# EAGLE design mainboard-raspi-3 (EAGLE 6.4)
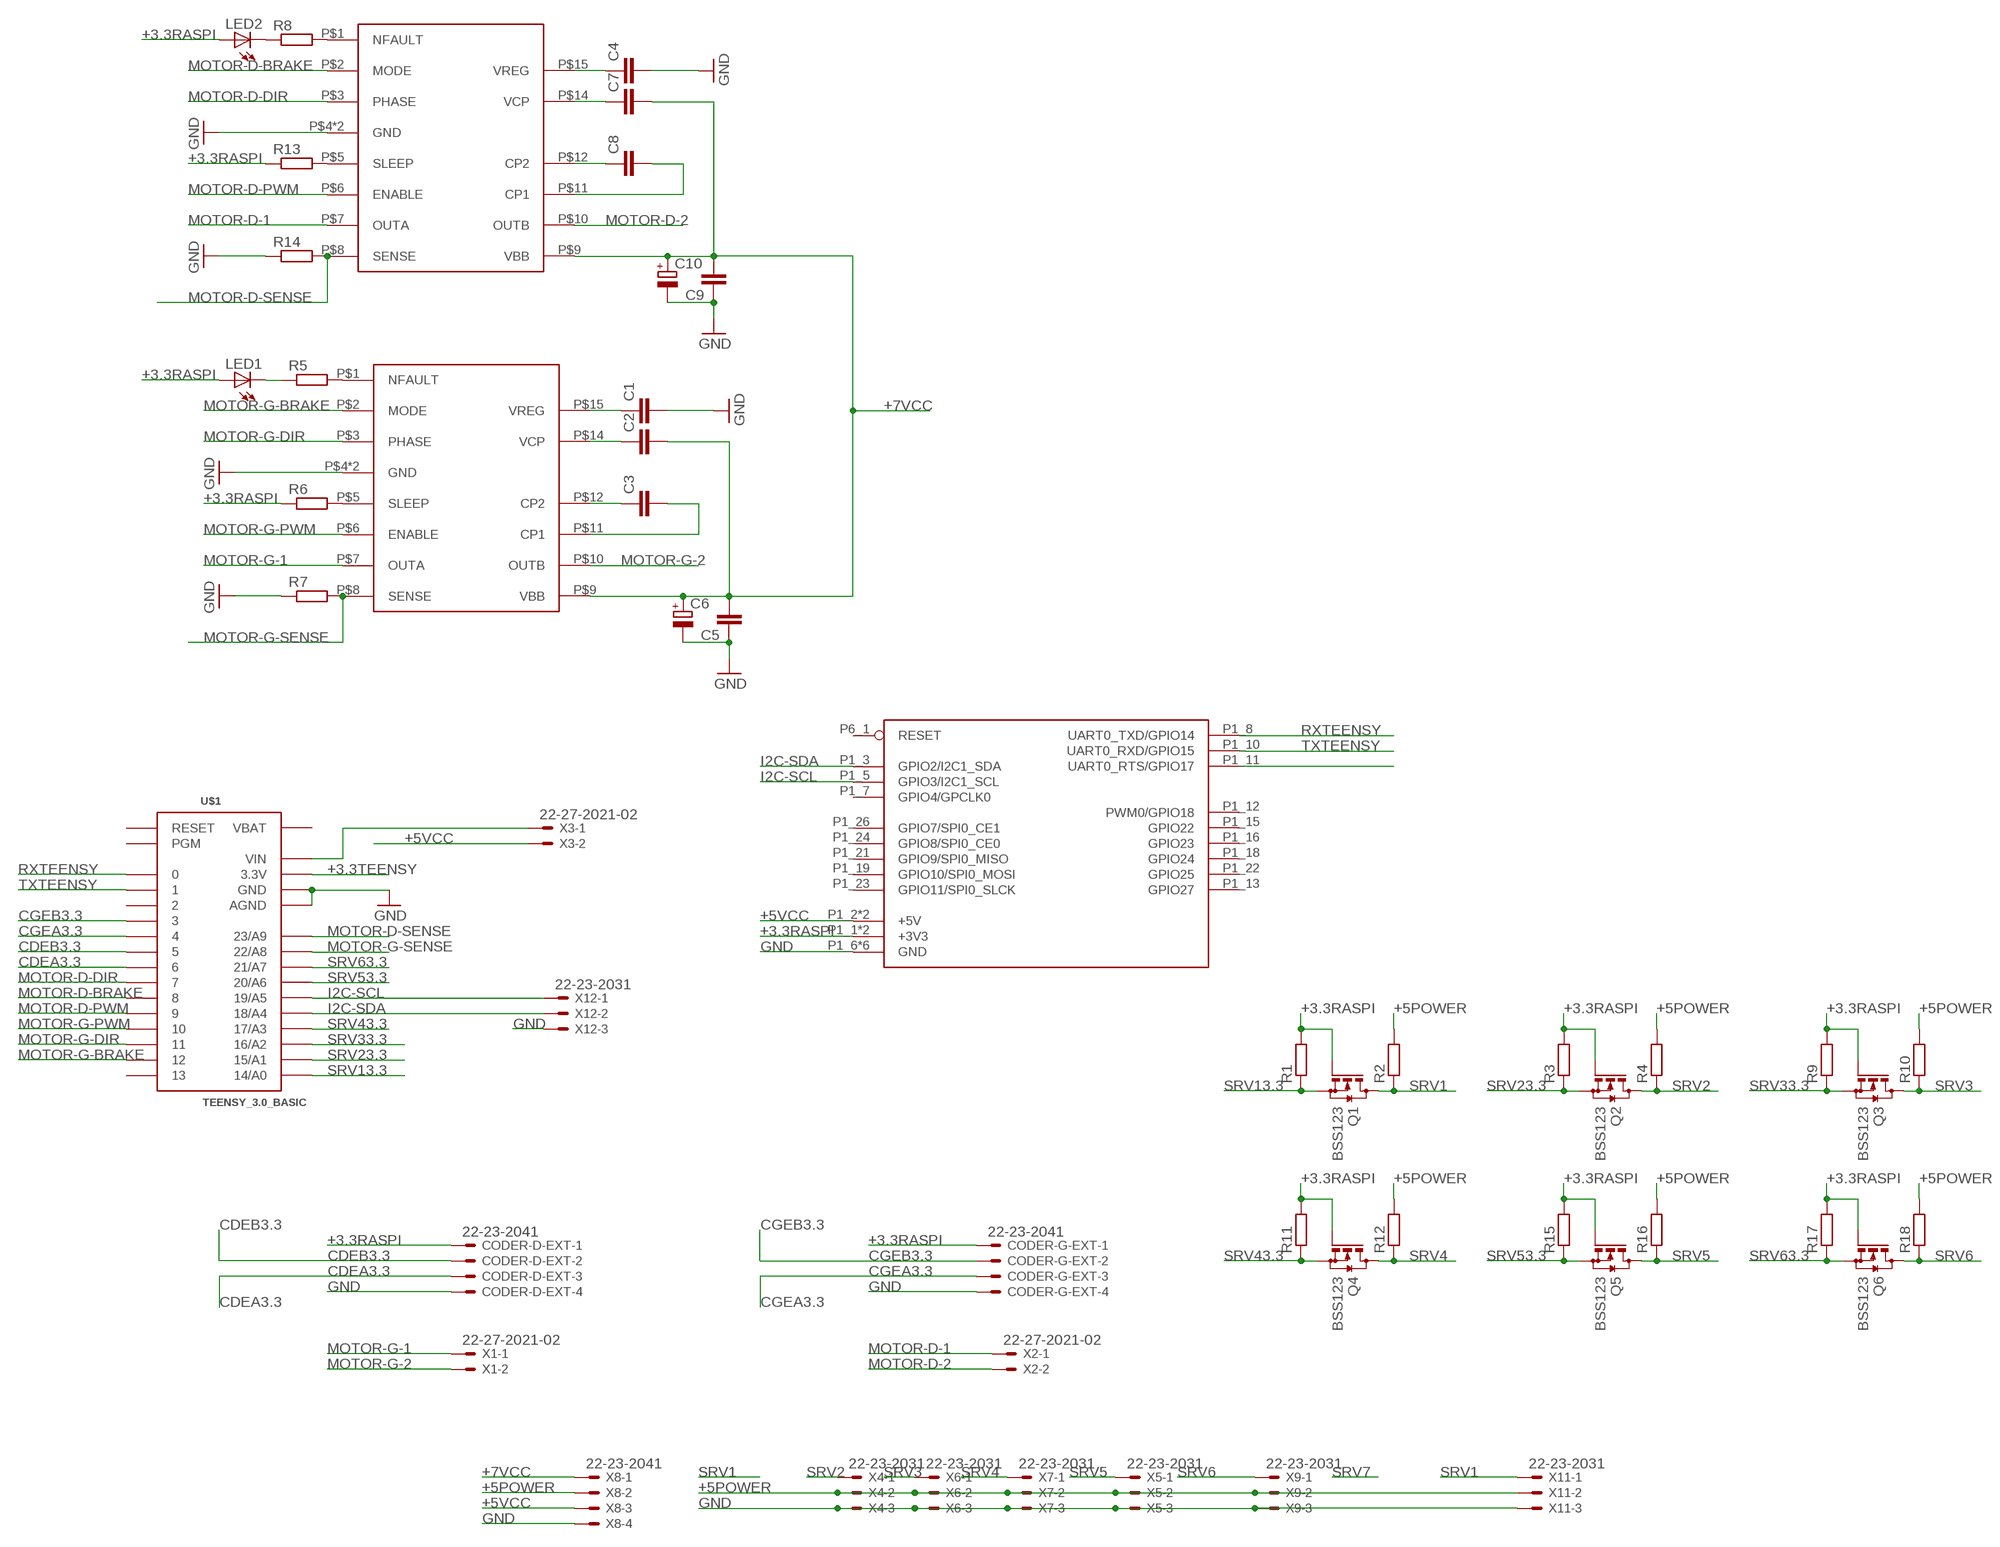
[diagram p0: schematic, sheet 1]

## Parts
C1  C-EUC0805K  [C0805K]
C2  C-EUC0805K  [C0805K]
C3  C-EUC0805K  [C0805K]
C4  C-EUC0805K  [C0805K]
C5  C-EUC0805K  [C0805K]
C6  CPOL-EUE3.5-8  [E3,5-8]
C7  C-EUC0805K  [C0805K]
C8  C-EUC0805K  [C0805K]
C9  C-EUC0805K  [C0805K]
C10  CPOL-EUE3.5-8  [E3,5-8]
CODER-D-EXT  22-23-2041  [22-23-2041]
CODER-G-EXT  22-23-2041  [22-23-2041]
LED1  LED3MM  [LED3MM]
LED2  LED3MM  [LED3MM]
Q1  BSS123  [SOT23]
Q2  BSS123  [SOT23]
Q3  BSS123  [SOT23]
Q4  BSS123  [SOT23]
Q5  BSS123  [SOT23]
Q6  BSS123  [SOT23]
R1  R-EU_R0603  [R0603]
R2  R-EU_R0603  [R0603]
R3  R-EU_R0603  [R0603]
R4  R-EU_R0603  [R0603]
R5  R-EU_0204/7  [0204/7]
R6  R-EU_0204/5  [0204/5]
R7  R-EU_0204/5  [0204/5]
R8  R-EU_0204/7  [0204/7]
R9  R-EU_R0603  [R0603]
R10  R-EU_R0603  [R0603]
R11  R-EU_R0603  [R0603]
R12  R-EU_R0603  [R0603]
R13  R-EU_0204/5  [0204/5]
R14  R-EU_0204/5  [0204/5]
R15  R-EU_R0603  [R0603]
R16  R-EU_R0603  [R0603]
R17  R-EU_R0603  [R0603]
R18  R-EU_R0603  [R0603]
U$1  TEENSY_3.0_BASIC  [TEENSY_3.0_BASIC]
U$2  RPI-B-V2SHIELD  [RPI-B-V2-SHIELD]
U$3  A3950-DIL  [DIL16]
U$4  A3950-DIL  [DIL16]
X1  22-27-2021-02  [6410-02]
X2  22-27-2021-02  [6410-02]
X3  22-27-2021-02  [6410-02]
X4  22-23-2031  [22-23-2031]
X5  22-23-2031  [22-23-2031]
X6  22-23-2031  [22-23-2031]
X7  22-23-2031  [22-23-2031]
X8  22-23-2041  [22-23-2041]
X9  22-23-2031  [22-23-2031]
X11  22-23-2031  [22-23-2031]
X12  22-23-2031  [22-23-2031]

## Nets
+3.3RASPI: CODER-D-EXT.1 CODER-G-EXT.1 LED1.A LED2.A Q1.1(G) Q2.1(G) Q3.1(G) Q4.1(G) Q5.1(G) Q6.1(G) R1.2 R3.2 R6.1 R9.2 R11.2 R13.1 R15.2 R17.2 U$2.P1_1(+3V3) U$2.P1_17(+3V3)
+3.3TEENSY: U$1.3.3V U$1.3.3V1(3.3V)
+5POWER: R2.2 R4.2 R10.2 R12.2 R16.2 R18.2 X4.2 X5.2 X6.2 X7.2 X8.2 X9.2 X11.2
+5VCC: U$2.P1_2(+5V) U$2.P1_4(+5V) X3.2 X8.3
+7VCC: C2.2 C5.2 C6.+ C7.2 C9.2 C10.+ U$3.P$9(VBB) U$4.P$9(VBB) X8.1
CDEA3.3: CODER-D-EXT.3 U$1.6
CDEB3.3: CODER-D-EXT.2 U$1.5
CGEA3.3: CODER-G-EXT.3 U$1.4
CGEB3.3: CODER-G-EXT.2 U$1.3
GND: C1.2 C4.2 C5.1 C6.- C9.1 C10.- CODER-D-EXT.4 CODER-G-EXT.4 R7.1 R14.1 U$1.AGND U$1.GND U$1.GND1(GND) U$2.P1_6(GND) U$2.P1_9(GND) U$2.P1_14(GND) U$2.P1_20(GND) U$2.P1_25(GND) U$2.P6_2(GND) U$3.P$4(GND) U$3.P$13(GND) U$4.P$4(GND) U$4.P$13(GND) X4.3 X5.3 X6.3 X7.3 X8.4 X9.3 X11.3 X12.3
I2C-SCL: U$1.19/A5 U$2.P1_5(GPIO3/I2C1_SCL) X12.1
I2C-SDA: U$1.18/A4 U$2.P1_3(GPIO2/I2C1_SDA) X12.2
MOTOR-D-1: U$4.P$7(OUTA) X2.1
MOTOR-D-2: U$4.P$10(OUTB) X2.2
MOTOR-D-BRAKE: U$1.8 U$4.P$2(MODE)
MOTOR-D-DIR: U$1.7 U$4.P$3(PHASE)
MOTOR-D-PWM: U$1.9 U$4.P$6(ENABLE)
MOTOR-D-SENSE: R14.2 U$1.23/A9 U$4.P$8(SENSE)
MOTOR-G-1: U$3.P$7(OUTA) X1.1
MOTOR-G-2: U$3.P$10(OUTB) X1.2
MOTOR-G-BRAKE: U$1.12 U$3.P$2(MODE)
MOTOR-G-DIR: U$1.11 U$3.P$3(PHASE)
MOTOR-G-PWM: U$1.10 U$3.P$6(ENABLE)
MOTOR-G-SENSE: R7.2 U$1.22/A8 U$3.P$8(SENSE)
N$2: U$2.P1_11(UART0_RTS/GPIO17)
N$3: U$1.VIN X3.1
N$5: R5.2 U$3.P$1(NFAULT)
N$6: R6.2 U$3.P$5(SLEEP)
N$7: R8.2 U$4.P$1(NFAULT)
N$8: C1.1 U$3.P$15(VREG)
N$9: C2.1 U$3.P$14(VCP)
N$10: C3.1 U$3.P$12(CP2)
N$11: LED1.K(C) R5.1
N$12: R13.2 U$4.P$5(SLEEP)
N$13: C4.1 U$4.P$15(VREG)
N$14: C7.1 U$4.P$14(VCP)
N$15: C3.2 U$3.P$11(CP1)
N$16: C8.1 U$4.P$12(CP2)
N$18: C8.2 U$4.P$11(CP1)
N$20: LED2.K(C) R8.1
RXTEENSY: U$1.0 U$2.P1_8(UART0_TXD/GPIO14)
SRV1: Q1.3(D) R2.1 X11.1
SRV2: Q2.3(D) R4.1 X4.1
SRV3: Q3.3(D) R10.1 X6.1
SRV4: Q4.3(D) R12.1 X7.1
SRV5: Q5.3(D) R16.1 X5.1
SRV6: Q6.3(D) R18.1 X9.1
SRV13.3: Q1.2(S) R1.1 U$1.14/A0
SRV23.3: Q2.2(S) R3.1 U$1.15/A1
SRV33.3: Q3.2(S) R9.1 U$1.16/A2
SRV43.3: Q4.2(S) R11.1 U$1.17/A3
SRV53.3: Q5.2(S) R15.1 U$1.20/A6
SRV63.3: Q6.2(S) R17.1 U$1.21/A7
TXTEENSY: U$1.1 U$2.P1_10(UART0_RXD/GPIO15)
Unconnected: U$1.2 U$1.13 U$1.PGM U$1.RESET U$2.P1_7(GPIO4/GPCLK0) U$2.P1_12(PWM0/GPIO18) U$2.P1_13(GPIO27) U$2.P1_15(GPIO22) U$2.P1_16(GPIO23) U$2.P1_18(GPIO24) U$2.P1_19(GPIO10/SPI0_MOSI) U$2.P1_21(GPIO9/SPI0_MISO) U$2.P1_22(GPIO25) U$2.P1_23(GPIO11/SPI0_SLCK) U$2.P1_24(GPIO8/SPI0_CE0) U$2.P1_26(GPIO7/SPI0_CE1)

## Power pins joined to a net without a drawn wire
RESET: U$2.P6_1(RESET)
VBAT: U$1.VBAT

## Library data of the parts
C1-C5 C7-C9 = rcl:C-EU: CAPACITOR, European symbol
C6 C10 = rcl:CPOL-EU: POLARIZED CAPACITOR, European symbol
CODER-D-EXT CODER-G-EXT X8 = con-molex:22-23-2041: .100" (2.54mm) Center Header - 4 Pin; MF: MOLEX; MPN: 22-23-2041; OC_FARNELL: 1462920; OC_NEWARK: 38C0355
LED1 LED2 = led:LED: LED OSRAM: - CHIPLED LG R971, LG N971, LY N971, LG Q971, LY Q971, LO R971, LY R971 LH N974, LH R974 LS Q976, LO Q976, LY Q976 LO Q996 - Hyper CHIPLED LW Q18S LB Q993, LB Q99A, LB R99A - SideLED LS A670, LO A670, LY A670, LG A670, LP A670 LB A673, LV A673, LT A673, LW A673 LH A674 LY A675 LS A676, LA A676, LO A676, LY A676, LW A676 LS A679, LY A679, LG A679 - Hyper Micro SIDELED® LS Y876, LA Y876, LO Y876, LY Y876 LT Y87S - SmartLED LW L88C, LW L88S LB L89C, LB L89S, LG L890 LS L89K, LO L89K, LY L89K LS L896, LA L896, LO L896, LY L896 - TOPLED LS T670, LO T670, LY T670, LG T670, LP T670 LSG T670, LSP T670, LSY T670, LOP T670, LYG T670 LG T671, LOG T671, LSG T671 LB T673, LV T673, LT T673, LW T673 LH T674 LS T676, LA T676, LO T676, LY T676, LB T676, LH T676, LSB T676, LW T676 LB T67C, LV T67C, LT T67C, LS T67K, LO T67K, LY T67K, LW E67C LS E67B, LA E67B, LO E67B, LY E67B, LB E67C, LV E67C, LT E67C LW T67C LS T679, LY T679, LG T679 LS T770, LO T770, LY T770, LG T770, LP T770 LB T773, LV T773, LT T773, LW T773 LH T774 LS E675, LA E675, LY E675, LS T675 LS T776, LA T776, LO T776, LY T776, LB T776 LHGB T686 LT T68C, LB T68C - Hyper Mini TOPLED® LB M676 - Mini TOPLED Santana® LG M470 LS M47K, LO M47K, LY M47K Source: http://www.osram.convergy.de LUXEON: - LUMILED® LXK2-PW12-R00, LXK2-PW12-S00, LXK2-PW14-U00, LXK2-PW14-V00 LXK2-PM12-R00, LXK2-PM12-S00, LXK2-PM14-U00 LXK2-PE12-Q00, LXK2-PE12-R00, LXK2-PE12-S00, LXK2-PE14-T00, LXK2-PE14-U00 LXK2-PB12-K00, LXK2-PB12-L00, LXK2-PB12-M00, LXK2-PB14-N00, LXK2-PB14-P00, LXK2-PB14-Q00 LXK2-PR12-L00, LXK2-PR12-M00, LXK2-PR14-Q00, LXK2-PR14-R00 LXK2-PD12-Q00, LXK2-PD12-R00, LXK2-PD12-S00 LXK2-PH12-R00, LXK2-PH12-S00 LXK2-PL12-P00, LXK2-PL12-Q00, LXK2-PL12-R00 Source: www.luxeon.com KINGBRIGHT: KA-3528ASYC Source: www.kingbright.com
Q1-Q6 = transistor-small-signal:BSS123: N-CHANNEL MOS FET
R1-R18 = rcl:R-EU_: RESISTOR, European symbol
U$1 = Teensy3.0:TEENSY_3.0_BASIC: Basic Teensy 3.0 with none of the 'inner' pins enabled. See '+4', 'AllAnalogPins", and 'AllPins' packages for additional pin holes, as needed.
U$2 = raspberry:RPI-B-V2: Second revision of the Model 2 board including the P5 and P6 headers. Mounting holes have been added. Choose the "SHIELD" variant for a predefined Dimension layer and drilling holes. Theres also a "SHIELD" variant for the Model A without a RJ45 connector.
U$3 U$4 = A3950:A3950-DIL
X1-X3 = con-molex:22-?-02: CONNECTOR wire to board 2.54 mm (.1 inch) pitch header; OC_FARNELL: unknown; OC_NEWARK: unknown
X4-X7 X9 X11 X12 = con-molex:22-23-2031: .100" (2.54mm) Center Header - 3 Pin; MF: MOLEX; MPN: 22-23-2031; OC_FARNELL: 1462950; OC_NEWARK: 30C0862

## Board
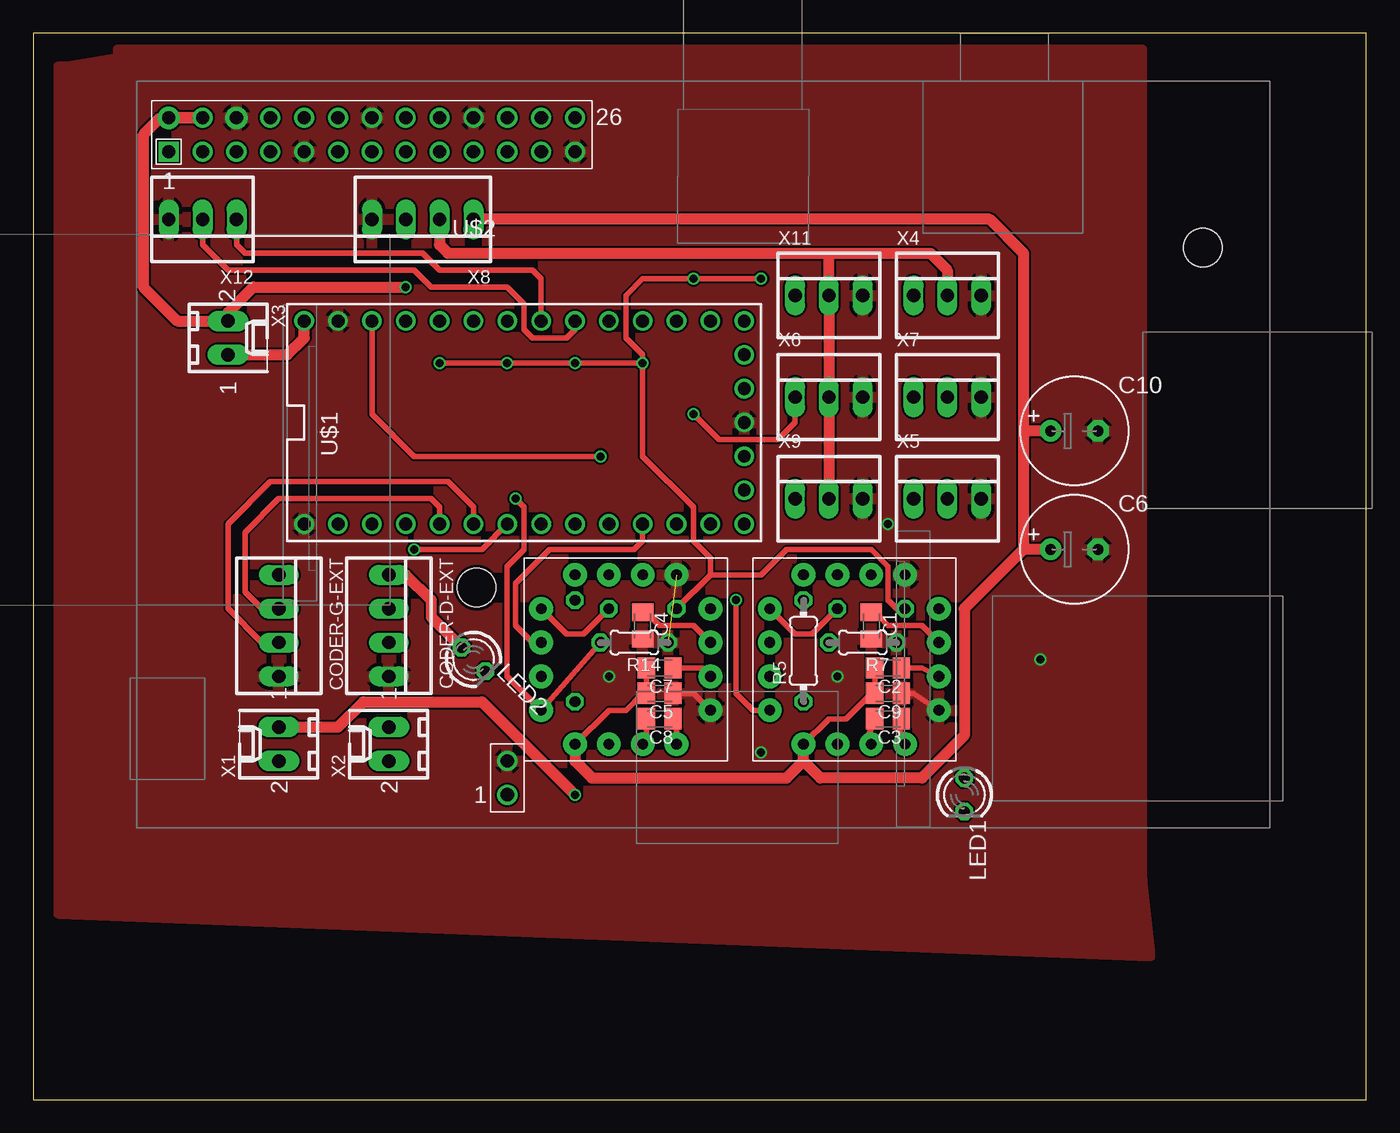
[diagram p1: board, top side]
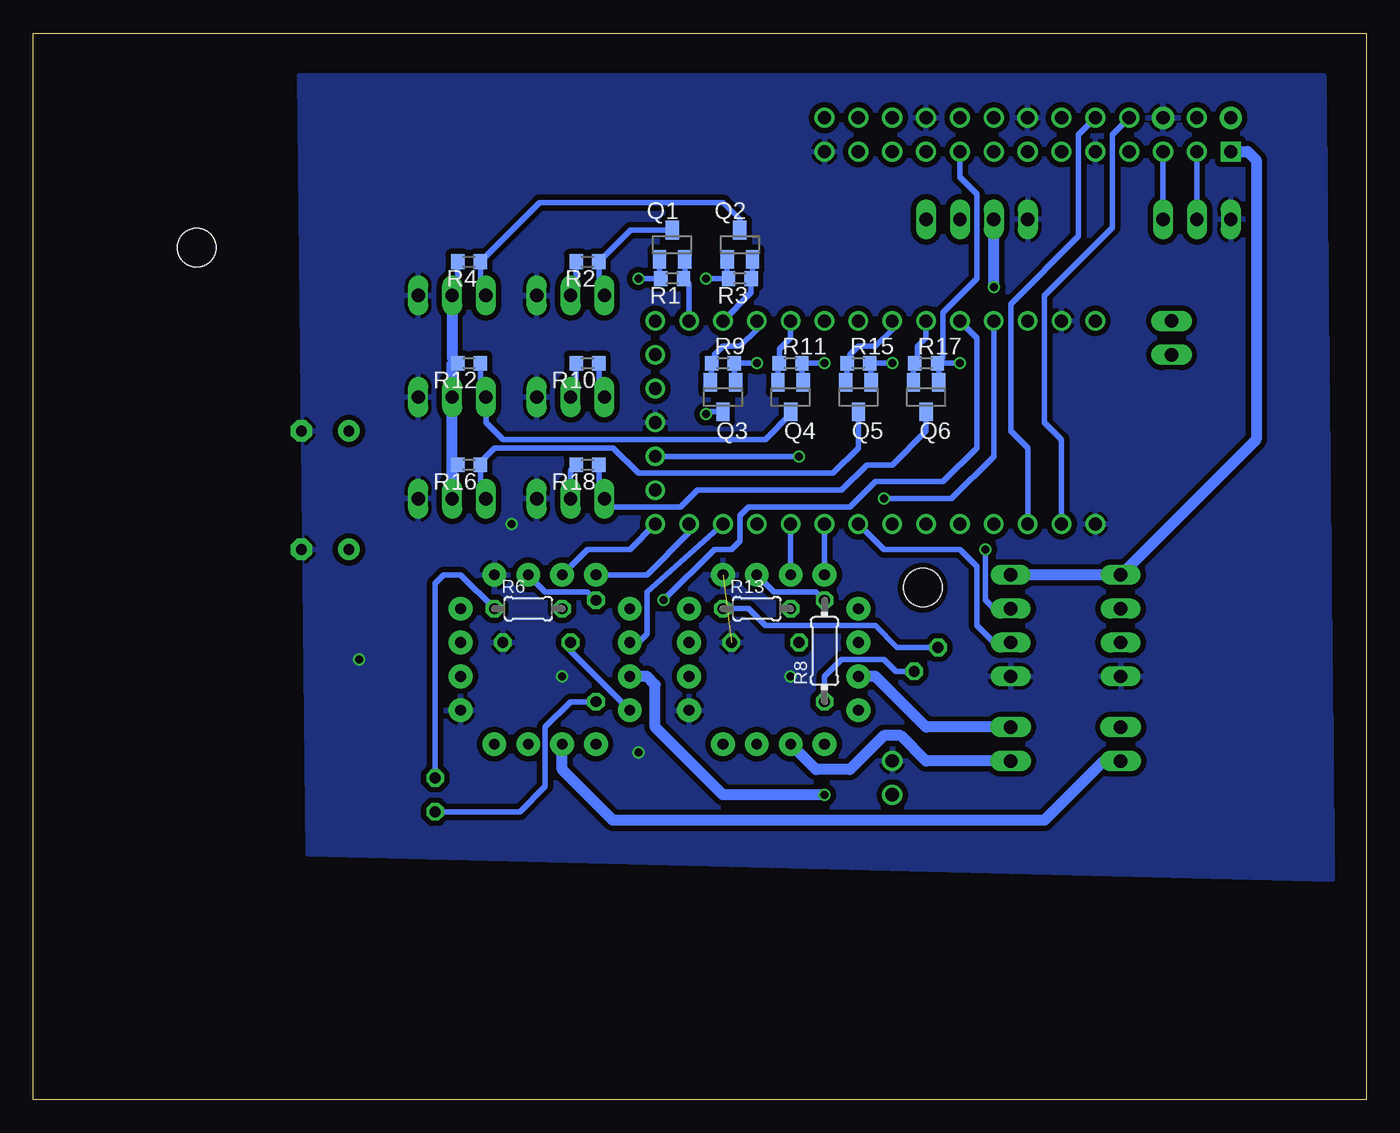
[diagram p2: board, bottom side, seen from below]

Size 100 x 80 mm. Coordinates in mm from the lower left corner, seen from the top.
Outline: 0,0 100,0 100,80 0,80 0,0
Copper layers (1*16): Top 0.035mm / dielectric 1.5mm / Bottom 0.035mm
Design rules "SeeedStudio_DRU_no_angle_2layer": minimum track width 6mil, minimum drill 12mil, track to track 6mil, track to pad 6mil, pad to pad 6mil, via to via 6mil, smd to smd 0mil, copper to edge 10mil, drill to drill 10mil, minimum pad ring 10mil, minimum via ring 6mil, stop-mask expansion 2mil, vias tented up to drill 25mil, thermal gap 10mil

### Footprints (pad centres in the part's own frame; a part is rotated, then mirrored left to right if it is on the bottom)
C0805K = smd 1.3 x 1.6: 1 -1,0; 2 1,0
E3,5-8 = drill 0.813 pad 1.6: + -1.778,0 | drill 0.813 pad 1.6 octagon: - 1.778,0
22-23-2041 = drill 1 long: 1 -3.81,0; 2 -1.27,0; 3 1.27,0; 4 3.81,0
LED3MM = drill 0.813 octagon: A -1.27,0; K 1.27,0
SOT23 = smd 1 x 1.4: 1 -0.95,-1.1; 2 0.95,-1.1; 3 0,1.1
R0603 = smd 1 x 1.1: 1 -0.85,0; 2 0.85,0
0204/7 = drill 0.813 octagon: 1 -3.81,0; 2 3.81,0
0204/5 = drill 0.813 octagon: 1 -2.54,0; 2 2.54,0
TEENSY_3.0_BASIC = drill 0.965: 0 -7.62,13.97; 1 -7.62,11.43; 2 -7.62,8.89; 3 -7.62,6.35; 3.3V 7.62,11.43; 3.3V1 -2.54,-16.51; 4 -7.62,3.81; 5 -7.62,1.27; 6 -7.62,-1.27; 7 -7.62,-3.81; 8 -7.62,-6.35; 9 -7.62,-8.89; 10 -7.62,-11.43; 11 -7.62,-13.97; 12 -7.62,-16.51; 13 7.62,-16.51; 14/A0 7.62,-13.97; 15/A1 7.62,-11.43; 16/A2 7.62,-8.89; 17/A3 7.62,-6.35; 18/A4 7.62,-3.81; 19/A5 7.62,-1.27; 20/A6 7.62,1.27; 21/A7 7.62,3.81; 22/A8 7.62,6.35; 23/A9 7.62,8.89; AGND 7.62,13.97; GND -7.62,16.51; GND1 0,-16.51; PGM 2.54,-16.51; RESET 5.08,-16.51; VBAT -5.08,-16.51; VIN 7.62,16.51
RPI-B-V2-SHIELD = drill 1 square: P1_1 0,0 | drill 1 pad 1.676: P1_2 0,2.54; P1_6 5.08,2.54 | drill 1: P1_3 2.54,0; P1_4 2.54,2.54; P1_5 5.08,0; P1_7 7.62,0; P1_8 7.62,2.54; P1_9 10.16,0; P1_10 10.16,2.54; P1_11 12.7,0; P1_12 12.7,2.54; P1_13 15.24,0; P1_14 15.24,2.54; P1_15 17.78,0; P1_16 17.78,2.54; P1_17 20.32,0; P1_18 20.32,2.54; P1_19 22.86,0; P1_20 22.86,2.54; P1_21 25.4,0; P1_22 25.4,2.54; P1_23 27.94,0; P1_24 27.94,2.54; P1_25 30.48,0; P1_26 30.48,2.54; P6_1 25.4,-48.26; P6_2 25.4,-45.72 | hole 2.9: 23.1,-32.72; 77.57,-7.21
DIL16 = drill 0.8 pad 1.778: P$1 -1.27,-6.35; P$2 1.27,-6.35; P$3 3.81,-6.35; P$4 -3.81,-6.35; P$5 6.35,-3.81; P$6 6.35,-1.27; P$7 6.35,1.27; P$8 6.35,3.81; P$9 3.81,6.35; P$10 1.27,6.35; P$11 -1.27,6.35; P$12 -3.81,6.35; P$13 -6.35,3.81; P$14 -6.35,1.27; P$15 -6.35,-1.27; P$16 -6.35,-3.81
6410-02 = drill 1.016 long: 1 1.27,0; 2 -1.27,0
22-23-2031 = drill 1 long: 1 -2.54,0; 2 0,0; 3 2.54,0

### Placement (x,y rotation side)
C1  62.86,35.56 270 top
C2  64.14,32.38 180 top
C3  64.14,28.57 180 top
C4  45.72,35.56 270 top
C5  46.99,30.48 180 top
C6  78.11,41.27 0 top
C7  46.99,32.38 180 top
C8  46.99,28.57 180 top
C9  64.14,30.48 180 top
C10  78.11,50.16 0 top
CODER-D-EXT  26.67,35.56 270 top
CODER-G-EXT  18.41,35.56 270 top
LED1  69.85,22.86 270 top
LED2  33.02,33.02 315 top
Q1  52.07,64.14 0 bottom
Q2  46.99,64.14 0 bottom
Q3  48.26,52.7 180 bottom
Q4  43.18,52.7 180 bottom
Q5  38.1,52.7 180 bottom
Q6  33.02,52.7 180 bottom
R1  52.07,61.59 180 bottom
R2  58.42,62.87 180 bottom
R3  46.99,61.59 180 bottom
R4  67.31,62.87 180 bottom
R5  57.78,33.66 90 top
R6  62.87,36.83 0 bottom
R7  62.23,34.29 180 top
R8  40.64,33.66 90 bottom
R9  48.26,55.24 0 bottom
R10  58.42,55.24 180 bottom
R11  43.18,55.24 0 bottom
R12  67.31,55.24 180 bottom
R13  45.72,36.83 0 bottom
R14  45.09,34.29 180 top
R15  38.1,55.24 0 bottom
R16  67.31,47.62 180 bottom
R17  33.02,55.24 0 bottom
R18  58.42,47.62 180 bottom
U$1  36.83,50.8 90 top
U$2  10.16,71.12 0 top
U$3  61.59,33.02 180 top
U$4  44.45,33.02 180 top
X1  18.42,26.67 90 top
X2  26.67,26.67 90 top
X3  14.61,57.15 270 top
X4  68.58,60.33 0 top
X5  68.58,45.09 0 top
X6  59.69,52.7 0 top
X7  68.58,52.7 0 top
X8  29.21,66.04 180 top
X9  59.69,45.09 0 top
X11  59.69,60.33 0 top
X12  12.7,66.04 180 top

### Tracks (layer width: path | path; a pad name or v marks a point on that pad's centre or on a via)
+3.3RASPI  (via drill 0.6)
  Top 0.406: 64.77,36.83 64.14,37.47 64.14,40.01 62.87,41.27 56.52,41.27 54.61,39.37 50.8,39.37 | 64.77,36.83 | 64.77,36.83 R6.1 | R13.1 50.8,39.37 | v30.48,55.24 v35.56,55.24 v40.64,55.24 v45.72,55.24 | v54.61,61.59 v49.53,61.59 45.72,61.59 44.45,60.33 44.45,57.15 45.72,55.88 v45.72,55.24 | 50.8,39.37 50.8,40.64 49.53,41.91 49.53,44.45 45.72,48.26 v45.72,55.24
  Top 0.813: CODER-D-EXT.1 27.94,39.37 29.84,37.47 29.84,36.2 LED2.A
  Bottom 0.406: LED2.A 35.19,33.92 36.83,35.56 45.09,35.56 46.35,36.83 R13.1 | LED1.A 69.85,38.73 69.22,39.37 67.94,39.37 R6.1 | U$2.P1_17 30.48,69.22 29.21,67.94 29.21,61.59 31.75,59.05 31.75,55.66 R17.2 | Q5.1 37.15,55.15 R15.2 v35.56,55.24 | Q6.1 32.07,55.15 R17.2 | R17.2 v30.48,55.24 | v40.64,55.24 R11.2 42.33,53.91 Q4.1 | Q3.1 47.41,53.91 R9.2 v45.72,55.24 | Q1.1 53.02,61.7 R1.2 v54.61,61.59 | Q2.1 47.94,61.7 R3.2 v49.53,61.59
  Bottom 0.813: U$2.P1_1 8.89,71.12 8.26,70.48 8.26,49.53 CODER-G-EXT.1 CODER-D-EXT.1
+3.3TEENSY  (via drill 0.6)
  Top 0.406: U$1.3.3V 25.4,51.44 28.57,48.26 v42.55,48.26
  Bottom 0.406: v42.55,48.26 U$1.3.3V1
+5POWER
  Top 0.813: X8.2 30.48,64.14 31.11,63.5 59.69,63.5 | 59.69,63.5 X11.2 X6.2 X9.2 | 59.69,63.5 67.31,63.5 68.58,62.23 X4.2
  Bottom 0.406: R12.2 68.58,55.24 | R16.2 68.58,47.62 | X11.2 59.27,60.74 R2.2 | X9.2 59.69,47.2 R18.2 | R10.2 59.27,53.12 X6.2 | R4.2 68.16,60.74 X4.2
  Bottom 0.813: X5.2 68.58,47.62 X7.2 68.58,55.24 | X4.2 68.58,55.66 R12.2
+5VCC  (via drill 0.6)
  Top 0.813: U$2.P1_2 U$2.P1_4 9.53,73.66 8.26,72.39 8.26,60.96 10.79,58.42 X3.2 14.61,59.05 16.51,60.96 v27.94,60.96
  Bottom 0.813: v27.94,60.96 X8.3
+7VCC
  Top 0.406: C7.2 C5.2 45.72,30.48 44.45,29.21 43.18,29.21 U$4.P$9 | C2.2 C9.2 62.87,30.48 60.96,28.57 59.69,28.57 U$3.P$9
  Top 0.813: 74.3,50.16 74.3,63.5 71.75,66.04 X8.1 | 74.3,50.16 74.3,41.27 | 74.3,41.27 69.85,36.83 69.85,27.3 66.67,24.13 59.05,24.13 57.78,25.4 | 57.78,25.4 U$3.P$9 | U$4.P$9 40.64,25.4 41.91,24.13 56.52,24.13 57.78,25.4 | C6.+ 74.3,41.27 | C10.+ 74.3,50.16
CDEA3.3
  Bottom 0.406: CODER-D-EXT.3 27.94,34.29 29.21,35.56 29.21,40.01 30.48,41.27 36.2,41.27 U$1.6
CDEB3.3  (via drill 0.6 pad 0.61)
  Top 0.406: U$1.5 33.66,41.27 v28.57,41.27
  Bottom 0.406: CODER-D-EXT.2 27.94,36.83 28.57,37.47 v28.57,41.27
CGEA3.3
  Top 0.406: CODER-G-EXT.3 17.14,34.29 14.61,36.83 14.61,43.18 17.78,46.35 31.11,46.35 33.02,44.45 U$1.4
CGEB3.3
  Top 0.406: CODER-G-EXT.2 17.14,36.83 15.88,38.1 15.88,42.55 18.41,45.09 29.84,45.09 30.48,44.45 U$1.3
GND  (via drill 0.6 pad 0.61)  (1 unrouted)
  Top 0.406: C5.1 49.53,30.48 U$4.P$13 | C9.1 66.04,30.48 U$3.P$13
  other vias: 43.18,31.75 60.33,31.75 64.14,43.18 75.56,33.02 54.61,26.04
  pour Bottom (isolate 0.406): 3.17,76.83 2.54,16.51 79.37,18.41 80.01,76.83
  pour Top: 2.54,77.47 1.91,77.47 1.91,13.97 83.82,10.79 83.19,16.51 83.19,78.74 6.35,78.74 6.35,78.11
I2C-SCL
  Top 0.406: X12.1 15.24,64.14 15.88,63.5 16.51,63.5 29.21,63.5 30.48,62.23 37.47,62.23 38.1,61.59 U$1.19/A5
  Bottom 0.406: X12.1 U$2.P1_5
I2C-SDA
  Top 0.406: 12.7,64.13 12.7,64.14 | 12.7,64.14 14.61,62.23 28.57,62.23 29.84,60.96 35.56,60.96 36.83,59.69 36.83,57.78 37.47,57.15 40.01,57.15 40.64,57.78 U$1.18/A4 | 12.7,64.14 X12.2
  Bottom 0.406: U$2.P1_3 X12.2
MOTOR-D-1
  Bottom 0.813: X2.1 33.02,27.94 36.83,31.75 U$4.P$7
MOTOR-D-2
  Bottom 0.813: X2.2 33.02,25.4 34.92,27.3 36.2,27.3 38.73,24.77 41.27,24.77 U$4.P$10
MOTOR-D-BRAKE
  Bottom 0.406: U$1.8 U$4.P$2
MOTOR-D-DIR
  Bottom 0.406: U$1.7 U$4.P$3
MOTOR-D-PWM
  Top 0.406: U$4.P$6 37.47,34.29 36.2,35.56 36.2,38.73 38.73,41.27 45.09,41.27 45.72,41.91 U$1.9
MOTOR-D-SENSE  (via drill 0.6 pad 0.61)
  Top 0.406: R14.2 U$4.P$8 35.56,31.75 35.56,40.01 36.83,41.27 36.83,44.45 v36.2,45.09
  Bottom 0.406: v36.2,45.09 31.11,45.09 27.94,48.26 U$1.23/A9
MOTOR-G-1  (via drill 0.6 pad 0.61)
  Top 0.813: X1.1 22.86,27.94 24.77,29.84 33.66,29.84 v40.64,22.86
  Bottom 0.813: v40.64,22.86 48.26,22.86 53.34,27.94 53.34,31.11 53.98,31.75 U$3.P$7
MOTOR-G-2
  Bottom 0.813: X1.2 19.68,25.4 24.13,20.95 56.52,20.95 60.33,24.77 U$3.P$10
MOTOR-G-BRAKE
  Bottom 0.406: U$1.12 55.24,41.27 58.42,41.27 U$3.P$2
MOTOR-G-DIR
  Bottom 0.406: U$1.11 50.8,42.55 53.98,39.37 U$3.P$3
MOTOR-G-PWM
  Bottom 0.406: U$1.10 53.98,38.1 53.98,34.92 54.61,34.29 U$3.P$6
MOTOR-G-SENSE  (via drill 0.6 pad 0.61)
  Top 0.406: v52.7,37.47 52.7,30.48 53.98,29.21 U$3.P$8
  Bottom 0.406: v52.7,37.47 48.9,41.27 47.62,41.27 46.99,41.91 46.99,43.81 46.35,44.45 38.73,44.45 36.83,46.35 31.75,46.35 29.21,48.9 29.21,57.15 U$1.22/A8 | U$3.P$8 59.69,33.66 R7.2
N$3
  Top 0.813: X3.1 19.05,55.88 20.32,57.15 U$1.VIN
N$5
  Bottom 0.406: R5.2 | R5.2 58.42,38.1 61.59,38.1 U$3.P$1
N$6
  Top 0.406: U$3.P$5 57.15,34.92 58.42,34.92 R6.2
N$7
  Bottom 0.406: R8.2 41.27,38.1 44.45,38.1 U$4.P$1
N$8
  Top 0.406: 62.5,36.56 C1.1 63.23,36.2 63.5,36.2 64.14,35.56 66.67,35.56 U$3.P$15
N$9
  Top 0.406: C2.1 66.67,32.38 U$3.P$14
N$10
  Top 0.406: U$3.P$12 64.77,28.3 C3.1
N$11
  Bottom 0.406: R5.1 59.69,29.84 61.59,27.94 61.59,23.5 63.5,21.59 LED1.K | LED1.K
N$12
  Top 0.406: U$4.P$5 40.01,34.92 41.27,34.92 R13.2
N$13
  Top 0.406: C4.1 45.99,36.56 46.99,35.56 49.53,35.56 U$4.P$15
N$14
  Top 0.406: C7.1 50.16,32.38 U$4.P$14
N$15
  Top 0.406: C3.2 62.5,26.94 U$3.P$11
N$16
  Top 0.406: U$4.P$12 48.26,28.3 C8.1
N$18
  Top 0.406: C8.2 45.99,26.94 U$4.P$11
N$20
  Bottom 0.406: LED2.K 35.3,32.12 36.2,33.02 39.37,33.02 40.64,31.75 R8.1
RXTEENSY
  Bottom 0.406: U$1.0 22.86,49.53 24.13,50.8 24.13,60.33 19.05,65.41 19.05,72.39 U$2.P1_8
SRV1
  Bottom 0.406: X11.1 57.57,60.74 R2.1 55.2,65.23 Q1.3
SRV2
  Bottom 0.406: X4.1 66.46,60.74 R4.1 62.02,67.31 48.26,67.31 46.99,66.04 Q2.3
SRV3  (via drill 0.6)
  Top 0.406: X6.1 57.15,50.8 55.88,49.53 51.44,49.53 v49.53,51.44
  Bottom 0.406: R10.1 57.57,53.12 X6.1 | Q3.3 49.36,51.6 v49.53,51.44
SRV4
  Bottom 0.406: R12.1 66.46,53.12 X7.1 66.04,50.8 64.77,49.53 45.09,49.53 43.18,51.44 Q4.3
SRV5
  Bottom 0.406: X5.1 66.46,45.51 R16.1 66.46,47.84 65.41,48.9 56.52,48.9 54.61,46.99 40.01,46.99 38.1,48.9 Q5.3
SRV6
  Bottom 0.406: R18.1 57.57,45.51 X9.1 56.52,44.45 51.44,44.45 50.16,45.72 39.37,45.72 37.47,47.62 35.56,47.62 33.02,50.16 Q6.3
SRV13.3
  Bottom 0.406: U$1.14/A0 50.8,61.17 R1.1 51.12,61.7 Q1.2
SRV23.3
  Bottom 0.406: U$1.15/A1 46.14,60.54 R3.1 46.04,61.7 Q2.2
SRV33.3
  Bottom 0.406: U$1.16/A2 45.72,57.78 46.99,56.52 48.26,56.52 48.9,55.88 48.9,55.46 R9.1 49.11,53.91 Q3.2
SRV43.3
  Bottom 0.406: Q4.2 44.13,55.15 R11.1 44.03,56.3 43.18,57.15 U$1.17/A3
SRV53.3
  Bottom 0.406: Q5.2 38.95,53.91 R15.1 38.73,55.46 38.73,55.88 38.1,56.52 36.83,56.52 35.56,57.78 U$1.20/A6
SRV63.3
  Bottom 0.406: U$1.21/A7 33.02,57.15 33.66,56.52 33.66,55.46 R17.1 33.97,55.15 Q6.2
TXTEENSY
  Bottom 0.406: U$1.1 25.4,48.9 26.67,50.16 26.67,59.69 21.59,64.77 21.59,72.39 U$2.P1_10